# Altium project MD016A.PrjPcb (part 1 of 3)
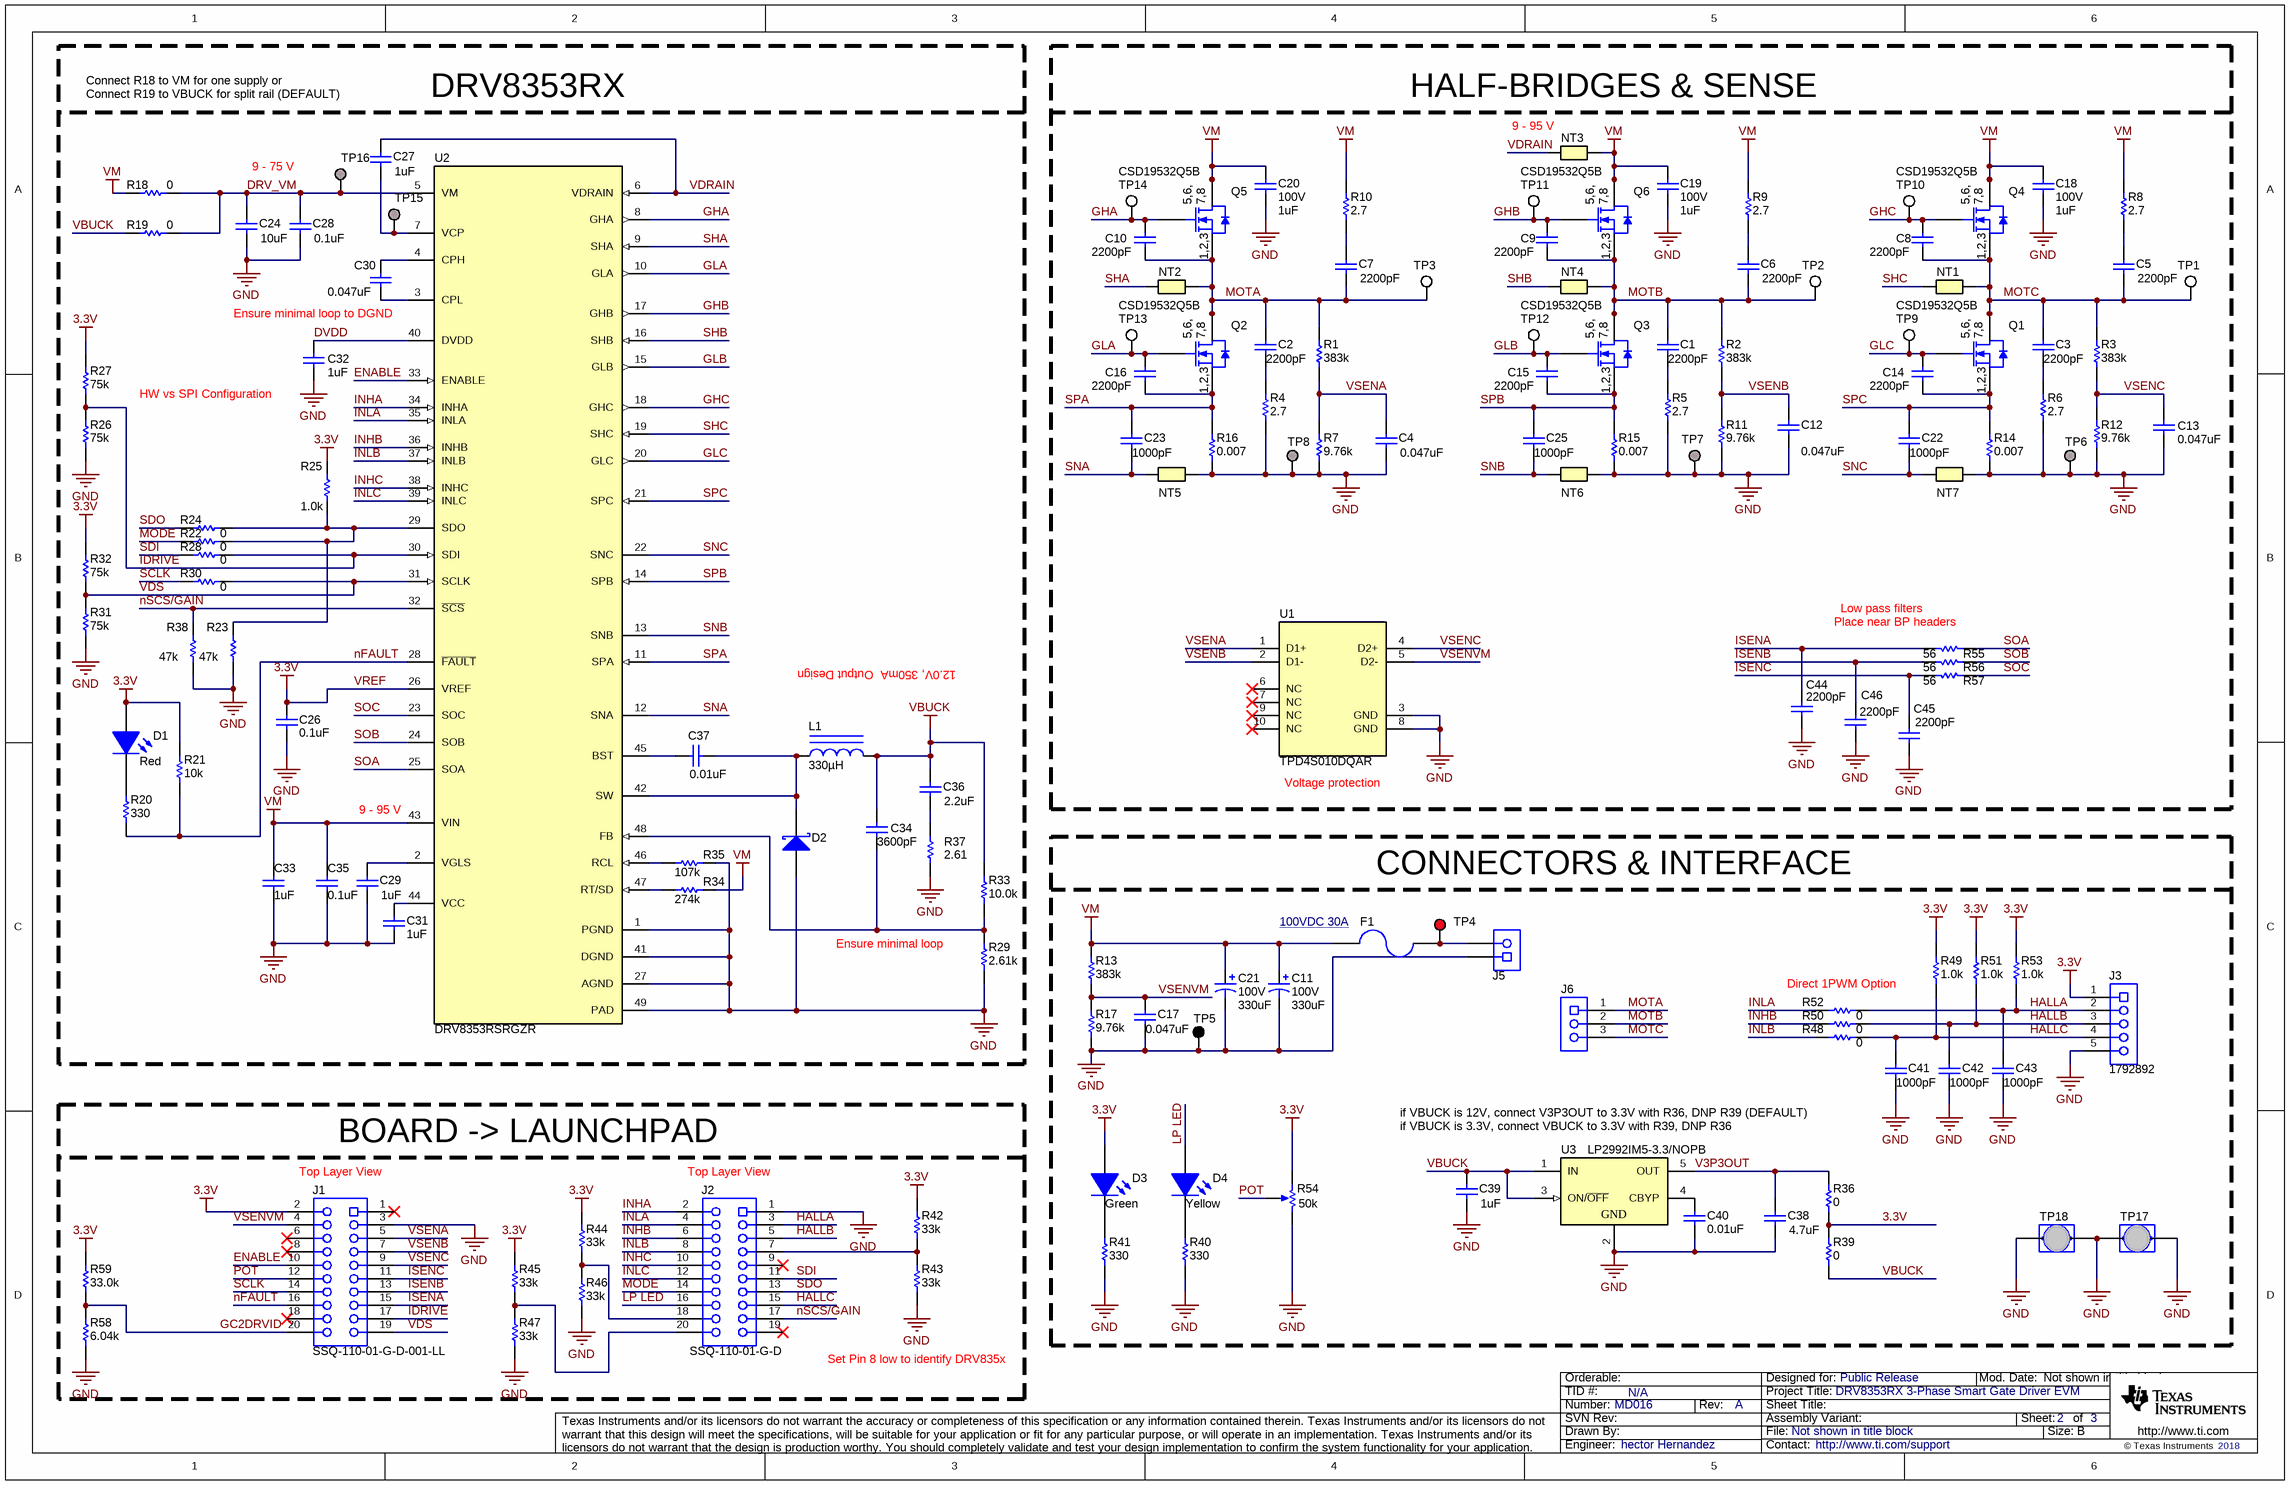
[diagram p0: MD016A.SchDoc]
CopyrightYear: 2018; PCB_Layout: Hector Hernandez; PCB_Rev: A; PRJ_Customer: Public Release; PRJ_Engineer: hector Hernandez; PRJ_Number: MD016; PRJ_Title: DRV8353RX 3-Phase Smart Gate Driver EVM; SCH_Rev: A; TechSupport: http://www.ti.com/support; TID: N/A
2 sheets, 179 parts. Net scope: global (net labels, ports and power ports of the same name join across sheets).
Board file: MD016A.PcbDoc
Sheets:
  MD016A.SchDoc
  MD016A_Hardware.SchDoc

## Sheet MD016A.SchDoc
size 431 x 279 mm; Date: Not shown in title block; ApprovedBy: Not shown in title block; CheckedBy: Not shown in title block; Author: Not shown in title block; CompanyName: Not shown in title block; Engineer: Not shown in title block; Organization: Not shown in title block; Address1: Not shown in title block; Address2: Not shown in title block; Address3: Not shown in title block; Address4: Not shown in title block; DocumentNumber: 1; Revision: Use project parameter SCH_Rev; SheetNumber: 2; SheetTotal: 3; PageSetup: Record=PageOptions|CenterHorizontal=True|CenterVertical=True|PrintScale=1.00|XCorrection=1.00|YCorrection=1.00|PrintKind=0|BorderSize=5000000|LeftOffset=0|BottomOffset=0|Orientation=2|PaperLength=1000|PaperWidth=1000|Scale=100|PaperSource=15|PrintQuality=600|MediaType=1|DitherType=10|PaperKind=Letter|PrintScaleMode=1; CurrentTime: Not shown in title block; CurrentDate: Not shown in title block; Time: Not shown in title block; DocumentFullPathAndName: Not shown in title block; DocumentName: Not shown in title block; ModifiedDate: Not shown in title block; ImagePath: Not shown in title block

### Parts
C1  ValueDisplayed: 2200pF  [0603_HV]  (hidden comment: GRM188R72A222KA01D)
C2  ValueDisplayed: 2200pF  [0603_HV]  (hidden comment: GRM188R72A222KA01D)
C3  ValueDisplayed: 2200pF  [0603_HV]  (hidden comment: GRM188R72A222KA01D)
C4  ValueDisplayed: 0.047uF  [0603L]  (hidden comment: 06033C473JAT2A)
C5  ValueDisplayed: 2200pF  [0603_HV]  (hidden comment: GRM188R72A222KA01D)
C6  ValueDisplayed: 2200pF  [0603_HV]  (hidden comment: GRM188R72A222KA01D)
C7  ValueDisplayed: 2200pF  [0603_HV]  (hidden comment: GRM188R72A222KA01D)
C8  ValueDisplayed: 2200pF  [0603_HV]  (hidden comment: 06031C222KAT2A)
C9  ValueDisplayed: 2200pF  [0603_HV]  (hidden comment: 06031C222KAT2A)
C10  ValueDisplayed: 2200pF  [0603_HV]  (hidden comment: 06031C222KAT2A)
C11  VDC_V: 100V  ValueDisplayed: 330uF  [SM_RADIAL_K16]  (hidden comment: EEV-FK2A331M)
C12  ValueDisplayed: 0.047uF  [0603L]  (hidden comment: 06033C473JAT2A)
C13  ValueDisplayed: 0.047uF  [0603L]  (hidden comment: 06033C473JAT2A)
C14  ValueDisplayed: 2200pF  [0603_HV]  (hidden comment: 06031C222KAT2A)
C15  ValueDisplayed: 2200pF  [0603_HV]  (hidden comment: 06031C222KAT2A)
C16  ValueDisplayed: 2200pF  [0603_HV]  (hidden comment: 06031C222KAT2A)
C17  ValueDisplayed: 0.047uF  [0603L]  (hidden comment: 06033C473JAT2A)
C18  VDC_V: 100V  ValueDisplayed: 1uF  [1206_180M]  (hidden comment: CL31B105KCHNNNE)
C19  VDC_V: 100V  ValueDisplayed: 1uF  [1206_180M]  (hidden comment: CL31B105KCHNNNE)
C20  VDC_V: 100V  ValueDisplayed: 1uF  [1206_180M]  (hidden comment: CL31B105KCHNNNE)
C21  VDC_V: 100V  ValueDisplayed: 330uF  [SM_RADIAL_K16]  (hidden comment: EEV-FK2A331M)
C22  ValueDisplayed: 1000pF  [0603L]  (hidden comment: 885012206034)
C23  ValueDisplayed: 1000pF  [0603L]  (hidden comment: 885012206034)
C24  ValueDisplayed: 10uF  [2220_280M]  (hidden comment: CGA9N3X7S2A106K230KE)
C25  ValueDisplayed: 1000pF  [0603L]  (hidden comment: 885012206034)
C26  ValueDisplayed: 0.1uF  [0603L]  (hidden comment: C0603C104J4RACTU)
C27  ValueDisplayed: 1uF  [1206_180M]  (hidden comment: CL31B105KCHNNNE)
C28  ValueDisplayed: 0.1uF  [0805_HV]  (hidden comment: C2012X7R2A104K125AA)
C29  ValueDisplayed: 1uF  [0603L]  (hidden comment: C1608X7R1C105K080AC)
C30  ValueDisplayed: 0.047uF  [0805_HV]  (hidden comment: C2012X7R2A473K125AA)
C31  ValueDisplayed: 1uF  [0603L]  (hidden comment: C1608X7R1C105K080AC)
C32  ValueDisplayed: 1uF  [0603L]  (hidden comment: EMK107B7105KA-T)
C33  ValueDisplayed: 1uF  [1206_180M]  (hidden comment: CL31B105KCHNNNE)
C34  ValueDisplayed: 3600pF  [0603L]  (hidden comment: GRM1885C1H362JA01D)
C35  ValueDisplayed: 0.1uF  [0805_HV]  (hidden comment: C2012X7R2A104K125AA)
C36  ValueDisplayed: 2.2uF  [0805L]  (hidden comment: C2012X7R1V225K085AC)
C37  ValueDisplayed: 0.01uF  [0603L]  (hidden comment: C0603C103K4RACTU)
C38  ValueDisplayed: 4.7uF  [1210_270L]  (hidden comment: GRM32ER71K475KE14L)
C39  ValueDisplayed: 1uF  [0805L]  (hidden comment: CL21B105KBFNNNE)
C40  ValueDisplayed: 0.01uF  [0603L]  (hidden comment: C0603C103K4RACTU)
C41  ValueDisplayed: 1000pF  [0603L]  (hidden comment: 885012206034)
C42  ValueDisplayed: 1000pF  [0603L]  (hidden comment: 885012206034)
C43  ValueDisplayed: 1000pF  [0603L]  (hidden comment: 885012206034)
C44  ValueDisplayed: 2200pF  [0603L]  (hidden comment: GRM188R71C222KA01D)
C45  ValueDisplayed: 2200pF  [0603L]  (hidden comment: GRM188R71C222KA01D)
C46  ValueDisplayed: 2200pF  [0603L]  (hidden comment: GRM188R71C222KA01D)
D1  value Red  [LED_LTST-C170_Red]  (hidden comment: LTST-C170KRKT)
D2  DFLS1200-7  [PowerDI123]  (value not drawn)
D3  value Green  [LTST-C170KGKT_Green]  (hidden comment: LTST-C170KGKT)
D4  value Yellow  [LED_LTST-C170]  (hidden comment: LTST-C170KSKT)
F1  100VDC 30A  [Fuse_0463]
J1  SSQ-110-01-G-D-001-LL  [Samtec_SSQ-110-01-x-D-001-LL]
J2  SSQ-110-01-G-D  [Samtec_SSQ-110-01-x-D]
J3  1792892  [Phoenix_1792892]
J5  1902547  [Phoenix_1902547]  (value not drawn)
J6  1904150  [Phoenix_1904150]  (value not drawn)
L1  ValueDisplayed: 330µH  [WE-LQS_8040]  (hidden comment: 74404084331)
NT1  Net-Tie  [Net-Tie_10mil]  (value not drawn)  (net tie, no BOM)
NT2  Net-Tie  [Net-Tie_10mil]  (value not drawn)  (net tie, no BOM)
NT3  Net-Tie  [Net-Tie_50milWide_30milLong]  (value not drawn)  (net tie, no BOM)
NT4  Net-Tie  [Net-Tie_10mil]  (value not drawn)  (net tie, no BOM)
NT5  Net-Tie  [Net-Tie_10mil]  (value not drawn)  (net tie, no BOM)
NT6  Net-Tie  [Net-Tie_10mil]  (value not drawn)  (net tie, no BOM)
NT7  Net-Tie  [Net-Tie_10mil]  (value not drawn)  (net tie, no BOM)
Q1  CSD19532Q5B  [DNK0008A]
Q2  CSD19532Q5B  [DNK0008A]
Q3  CSD19532Q5B  [DNK0008A]
Q4  CSD19532Q5B  [DNK0008A]
Q5  CSD19532Q5B  [DNK0008A]
Q6  CSD19532Q5B  [DNK0008A]
R1  ValueDisplayed: 383k  [0603_HV]  (hidden comment: CRCW0603383KFKEA)
R2  ValueDisplayed: 383k  [0603_HV]  (hidden comment: CRCW0603383KFKEA)
R3  ValueDisplayed: 383k  [0603_HV]  (hidden comment: CRCW0603383KFKEA)
R4  ValueDisplayed: 2.7  [0805_HV]  (hidden comment: CRCW08052R70JNEA)
R5  ValueDisplayed: 2.7  [0805_HV]  (hidden comment: CRCW08052R70JNEA)
R6  ValueDisplayed: 2.7  [0805_HV]  (hidden comment: CRCW08052R70JNEA)
R7  ValueDisplayed: 9.76k  [0603L]  (hidden comment: RC0603FR-079K76L)
R8  ValueDisplayed: 2.7  [0805_HV]  (hidden comment: CRCW08052R70JNEA)
R9  ValueDisplayed: 2.7  [0805_HV]  (hidden comment: CRCW08052R70JNEA)
R10  ValueDisplayed: 2.7  [0805_HV]  (hidden comment: CRCW08052R70JNEA)
R11  ValueDisplayed: 9.76k  [0603L]  (hidden comment: RC0603FR-079K76L)
R12  ValueDisplayed: 9.76k  [0603L]  (hidden comment: RC0603FR-079K76L)
R13  ValueDisplayed: 383k  [0603_HV]  (hidden comment: CRCW0603383KFKEA)
R14  ValueDisplayed: 0.007  [CRE2512-R5_R9]  (hidden comment: CRE2512-FZ-R007E-3)
R15  ValueDisplayed: 0.007  [CRE2512-R5_R9]  (hidden comment: CRE2512-FZ-R007E-3)
R16  ValueDisplayed: 0.007  [CRE2512-R5_R9]  (hidden comment: CRE2512-FZ-R007E-3)
R17  ValueDisplayed: 9.76k  [0603L]  (hidden comment: RC0603FR-079K76L)
R18  ValueDisplayed: 0  [1206]  (hidden comment: RC1206JR-070RL)
R19  ValueDisplayed: 0  [1206]  (hidden comment: RC1206JR-070RL)
R20  ValueDisplayed: 330  [0603L]  (hidden comment: CRCW0603330RJNEA)
R21  ValueDisplayed: 10k  [0603L]  (hidden comment: RC0603JR-0710KL)
R22  ValueDisplayed: 0  [0603L]  (hidden comment: ERJ-3GEY0R00V)
R23  ValueDisplayed: 47k  [0603L]  (hidden comment: CRCW060347K0JNEA)
R24  ValueDisplayed: 0  [0603L]  (hidden comment: ERJ-3GEY0R00V)
R25  ValueDisplayed: 1.0k  [0603L]  (hidden comment: RCA06031K00JNEA)
R26  ValueDisplayed: 75k  [0603L]  (hidden comment: CRCW060375K0JNEA)
R27  ValueDisplayed: 75k  [0603L]  (hidden comment: CRCW060375K0JNEA)
R28  ValueDisplayed: 0  [0603L]  (hidden comment: ERJ-3GEY0R00V)
R29  ValueDisplayed: 2.61k  [0603L]  (hidden comment: RG1608P-2611-B-T5)
R30  ValueDisplayed: 0  [0603L]  (hidden comment: ERJ-3GEY0R00V)
R31  ValueDisplayed: 75k  [0603L]  (hidden comment: CRCW060375K0JNEA)
R32  ValueDisplayed: 75k  [0603L]  (hidden comment: CRCW060375K0JNEA)
R33  ValueDisplayed: 10.0k  [0603L]  (hidden comment: RG1608P-103-B-T5)
R34  ValueDisplayed: 274k  [0603_HV]  (hidden comment: RC0603FR-07274KL)
R35  ValueDisplayed: 107k  [0603L]  (hidden comment: RC0603FR-07107KL)
R36  ValueDisplayed: 0  [0603L]  (hidden comment: ERJ-3GEY0R00V)
R37  ValueDisplayed: 2.61  [0603L]  (hidden comment: CRCW06032R61FKEA)
R38  ValueDisplayed: 47k  [0603L]  (hidden comment: CRCW060347K0JNEA)
R39  ValueDisplayed: 0  [0603L]  (hidden comment: ERJ-3GEY0R00V)
R40  ValueDisplayed: 330  [0603L]  (hidden comment: CRCW0603330RJNEA)
R41  ValueDisplayed: 330  [0603L]  (hidden comment: CRCW0603330RJNEA)
R42  ValueDisplayed: 33k  [0603L]  (hidden comment: Resistor)
R43  ValueDisplayed: 33k  [0603L]  (hidden comment: Resistor)
R44  ValueDisplayed: 33k  [0603L]  (hidden comment: Resistor)
R45  ValueDisplayed: 33k  [0603L]  (hidden comment: Resistor)
R46  ValueDisplayed: 33k  [0603L]  (hidden comment: Resistor)
R47  ValueDisplayed: 33k  [0603L]  (hidden comment: Resistor)
R48  ValueDisplayed: 0  [0603L]  (hidden comment: ERJ-3GEY0R00V)
R49  ValueDisplayed: 1.0k  [0603L]  (hidden comment: RCA06031K00JNEA)
R50  ValueDisplayed: 0  [0603L]  (hidden comment: ERJ-3GEY0R00V)
R51  ValueDisplayed: 1.0k  [0603L]  (hidden comment: RCA06031K00JNEA)
R52  ValueDisplayed: 0  [0603L]  (hidden comment: ERJ-3GEY0R00V)
R53  ValueDisplayed: 1.0k  [0603L]  (hidden comment: RCA06031K00JNEA)
R54  value 50k  [Bourns_3352T]  (hidden comment: 3352T-1-503LF)
R55  value 56  [0603L]  (hidden comment: CRCW060356R0JNEA)
R56  value 56  [0603L]  (hidden comment: CRCW060356R0JNEA)
R57  value 56  [0603L]  (hidden comment: CRCW060356R0JNEA)
R58  ValueDisplayed: 6.04k  [0603L]  (hidden comment: RG1608P-6041-B-T5)
R59  ValueDisplayed: 33.0k  [0603L]  (hidden comment: MCT06030C3302FP500)
TP1  5002  [Keystone5002]  (value not drawn)
TP2  5002  [Keystone5002]  (value not drawn)
TP3  5002  [Keystone5002]  (value not drawn)
TP4  5000  [Keystone5000]  (value not drawn)
TP5  5001  [Keystone5001]  (value not drawn)
TP6  TP_SM_1MM  [TP_SM_1MM]  (value not drawn)  (no BOM)
TP7  TP_SM_1MM  [TP_SM_1MM]  (value not drawn)  (no BOM)
TP8  TP_SM_1MM  [TP_SM_1MM]  (value not drawn)  (no BOM)
TP9  5002  [Keystone5002]  (value not drawn)
TP10  5002  [Keystone5002]  (value not drawn)
TP11  5002  [Keystone5002]  (value not drawn)
TP12  5002  [Keystone5002]  (value not drawn)
TP13  5002  [Keystone5002]  (value not drawn)
TP14  5002  [Keystone5002]  (value not drawn)
TP15  TP_SM_1MM  [TP_SM_1MM]  (value not drawn)  (no BOM)
TP16  TP_SM_1MM  [TP_SM_1MM]  (value not drawn)  (no BOM)
TP17  D3082-05  [Harwin_D3082-05]  (value not drawn)
TP18  D3082-05  [Harwin_D3082-05]  (value not drawn)
U1  TPD4S010DQAR  [DQA0010A]
U2  DRV8353RSRGZR  [RGZ0048L]
U3  LP2992IM5-3.3/NOPB  [DBV0005A_L]

### Blocks framed on the sheet
DRV8353RX: C24 C26-C37 D1 D2 L1 R18-R35 R37 R38 TP15 TP16 U2
HALF-BRIDGES & SENSE: C1-C10 C12-C16 C18-C20 C22 C23 C25 C44-C46 NT1-NT7 Q1-Q6 R1-R12 R14-R16 R55-R57 TP1-TP3 TP6-TP14 U1
CONNECTORS & INTERFACE: C11 C17 C21 C38-C43 D3 D4 F1 J3 J5 J6 R13 R17 R36 R39-R41 R48-R54 TP4 TP5 TP17 TP18 U3
BOARD -> LAUNCHPAD: J1 J2 R42-R47 R58 R59

### Nets
3.3V: C26.1 D1.1(A) D3.1(A) J1.2 J3.1 R21.2 R25.2 R27.2 R32.2 R36.1 R39.2 R42.2 R44.2 R45.2 R49.2 R51.2 R53.2 R54.3(CW) R59.2 U2.26(VREF)  [also labelled VREF]
GND: C4.2 C11.2(-) C12.2 C13.2 C17.2 C18.2 C19.2 C20.2 C21.2(-) C24.2 C26.2 C28.2 C29.2 C31.1 C32.2 C33.2 C35.2 C38.2 C39.2 C40.2 C41.2 C42.2 C43.2 C44.2 C45.2 C46.2 D2.2(A) J1.3 J2.1 J3.5 J5.1 NT5.2 NT6.2 NT7.2 R4.1 R5.1 R6.1 R7.1 R11.1 R12.1 R14.1 R15.1 R16.1 R17.1 R23.2 R26.1 R29.1 R31.1 R35.2 R37.1 R38.2 R40.1 R41.1 R43.1 R46.1 R47.1 R54.1(CCW) R58.1 TP5.1 TP6.1 TP7.1 TP8.1 TP17.1 TP17.2 TP18.1 TP18.2 U1.3(GND) U1.8(GND) U2.1(PGND) U2.27(AGND) U2.41(DGND) U2.49(PAD) U3.2(GND)
VBUCK: C34.1 C36.1 C39.1 L1.2 R19.1 R33.2 R39.1 U3.1(IN) U3.3(ON/~{OFF})
VM: C11.1(+) C18.1 C19.1 C20.1 C21.1(+) C33.1 C35.1 F1.2 NT3.2 Q4.5(D) Q4.6(D) Q4.7(D) Q4.8(D) Q4.9(D) Q5.5(D) Q5.6(D) Q5.7(D) Q5.8(D) Q5.9(D) Q6.5(D) Q6.6(D) Q6.7(D) Q6.8(D) Q6.9(D) R8.2 R9.2 R10.2 R13.2 R18.1 R34.2 U2.43(VIN)
DRV_VM: C24.1 C28.1 R18.2 R19.2 TP16.1 U2.5(VM)
DVDD: C32.1 U2.40(DVDD)
ENABLE: J1.10 U2.33(ENABLE)
GC2DRVID: J1.20 R58.2 R59.1
GHA: C10.1 Q5.4(G) TP14.1 U2.8(GHA)
GHB: C9.1 Q6.4(G) TP11.1 U2.17(GHB)
GHC: C8.1 Q4.4(G) TP10.1 U2.18(GHC)
GLA: C16.1 Q2.4(G) TP13.1 U2.10(GLA)
GLB: C15.1 Q3.4(G) TP12.1 U2.15(GLB)
GLC: C14.1 Q1.4(G) TP9.1 U2.20(GLC)
HALLA: C43.1 J2.3 J3.2 R52.2 R53.1
HALLB: C42.1 J2.5 J3.3 R50.2 R51.1
HALLC: C41.1 J2.15 J3.4 R48.2 R49.1
IDRIVE: J1.17 R26.2 R27.1 R28.2 U2.30(SDI)
INHA: J2.2 U2.34(INHA)
INHB: J2.6 R50.1 U2.36(INHB)
INHC: J2.10 U2.38(INHC)
INLA: J2.4 R52.1 U2.35(INLA)
INLB: J2.8 R48.1 U2.37(INLB)
INLC: J2.12 U2.39(INLC)
ISENA: C44.1 J1.15 R55.2
ISENB: C46.1 J1.13 R56.2
ISENC: C45.1 J1.11 R57.2
LP LED: D4.1(A) J2.16
MODE: J2.14 R22.1
MOTA: C2.1 C7.2 C10.2 J6.1 NT2.2 Q2.5(D) Q2.6(D) Q2.7(D) Q2.8(D) Q2.9(D) Q5.1(S) Q5.2(S) Q5.3(S) R1.2 TP3.1
MOTB: C1.1 C6.2 C9.2 J6.2 NT4.2 Q3.5(D) Q3.6(D) Q3.7(D) Q3.8(D) Q3.9(D) Q6.1(S) Q6.2(S) Q6.3(S) R2.2 TP2.1
MOTC: C3.1 C5.2 C8.2 J6.3 NT1.2 Q1.5(D) Q1.6(D) Q1.7(D) Q1.8(D) Q1.9(D) Q4.1(S) Q4.2(S) Q4.3(S) R3.2 TP1.1
nFAULT: J1.16 R20.1 R21.1 U2.28(~{FAULT})
nSCS/GAIN: J2.17 R38.1 U2.32(~{SCS})
POT: J1.12 R54.2(WIPER)
SCLK: J1.14 R30.1
SDI: J2.11 R28.1
SDO: J2.13 R24.1
SHA: NT2.1 U2.9(SHA)
SHB: NT4.1 U2.16(SHB)
SHC: NT1.1 U2.19(SHC)
SNA: C23.2 NT5.1 U2.12(SNA)
SNB: C25.2 NT6.1 U2.13(SNB)
SNC: C22.2 NT7.1 U2.22(SNC)
SOA: R55.1 U2.25(SOA)
SOB: R56.1 U2.24(SOB)
SOC: R57.1 U2.23(SOC)
SPA: C16.2 C23.1 Q2.1(S) Q2.2(S) Q2.3(S) R16.2 U2.11(SPA)
SPB: C15.2 C25.1 Q3.1(S) Q3.2(S) Q3.3(S) R15.2 U2.14(SPB)
SPC: C14.2 C22.1 Q1.1(S) Q1.2(S) Q1.3(S) R14.2 U2.21(SPC)
V3P3OUT: C38.1 R36.2 U3.5(OUT)
VDRAIN: C27.1 NT3.1 U2.6(VDRAIN)
VDS: J1.19 R30.2 R31.2 R32.1 U2.31(SCLK)
VSENA: C4.1 J1.5 R1.1 R7.2 U1.1(D1+)
VSENB: C12.1 J1.7 R2.1 R11.2 U1.2(D1-)
VSENC: C13.1 J1.9 R3.1 R12.2 U1.4(D2+)
VSENVM: C17.1 J1.4 R13.1 R17.2 U1.5(D2-)
NetC1_2: C1.2 R5.2
NetC2_2: C2.2 R4.2
NetC3_2: C3.2 R6.2
NetC5_1: C5.1 R8.1
NetC6_1: C6.1 R9.1
NetC7_1: C7.1 R10.1
NetC27_2: C27.2 TP15.1 U2.7(VCP)
NetC29_1: C29.1 U2.2(VGLS)
NetC30_1: C30.1 U2.4(CPH)
NetC30_2: C30.2 U2.3(CPL)
NetC31_2: C31.2 U2.44(VCC)
NetC34_2: C34.2 R29.2 R33.1 U2.48(FB)
NetC36_2: C36.2 R37.2
NetC37_1: C37.1 D2.1(K) L1.1 U2.42(SW)
NetC37_2: C37.2 U2.45(BST)
NetC40_1: C40.1 U3.4(CBYP)
NetD1_2: D1.2(K) R20.2
NetD3_2: D3.2(K) R41.2
NetD4_2: D4.2(K) R40.2
NetF1_1: F1.1 J5.2 TP4.1
NetJ2_7: J2.7 R42.1 R43.2
NetJ2_18: J2.18 R44.1 R46.2
NetJ2_20: J2.20 R45.1 R47.2
NetR22_2: R22.2 R23.1 R24.2 R25.1 U2.29(SDO)
NetR34_1: R34.1 U2.47(RT/SD)
NetR35_1: R35.1 U2.46(RCL)

Not connected (* = marked no-connect by the designer): J1 1* 6* 8* 18*; J2 9* 19*; U1 6(NC)* 7(NC)* 9(NC)* 10(NC)*

### Notes on the sheet
- Connect R18 to VM for one supply or
  Connect R19 to VBUCK for split rail (DEFAULT)
- 9 - 75 V
- (near NT3) 9 - 95 V
- Ensure minimal loop to DGND
- HW vs SPI Configuration
- Low pass filters
- Place near BP headers
- 12.0V, 350mA  Output Design
- (near U2) 9 - 95 V
- (near U1) Voltage protection
- Ensure minimal loop
- Direct 1PWM Option
- (near J1) Top Layer View
- (near J2) Top Layer View
- if VBUCK is 12V, connect V3P3OUT to 3.3V with R36, DNP R39 (DEFAULT)
  if VBUCK is 3.3V, connect VBUCK to 3.3V with R39, DNP R36
- Set Pin 8 low to identify DRV835x
- Drawn By:
- SVN Rev:
- Number:
- TID #:
- Orderable:
- Rev:
- Sheet Title:
- File:
- Project Title:
- Designed for:
- Assembly Variant:
- Mod. Date:
- Sheet:
- Size:
- of
- B
- http://www.ti.com
- Texas Instruments and/or its licensors do not warrant the accuracy or completeness of this specification or any information contained therein. Texas Instruments and/or its licensors do not warrant that this design will meet the specifications, will be suitable for your application or fit for any particular purpose, or will operate in an implementation. Texas Instruments and/or its licensors do not warrant that the design is production worthy. You should completely validate and test your design implementation to confirm the system functionality for your application.
- Engineer:
- Contact:
- © Texas Instruments
- (in symbol CMP-0000958-3) 5,6,; 7,8; 1,2,3